# Altium schematic sheet Amplifier.SchDoc
size A; SheetNumber: 11; SheetTotal: 12
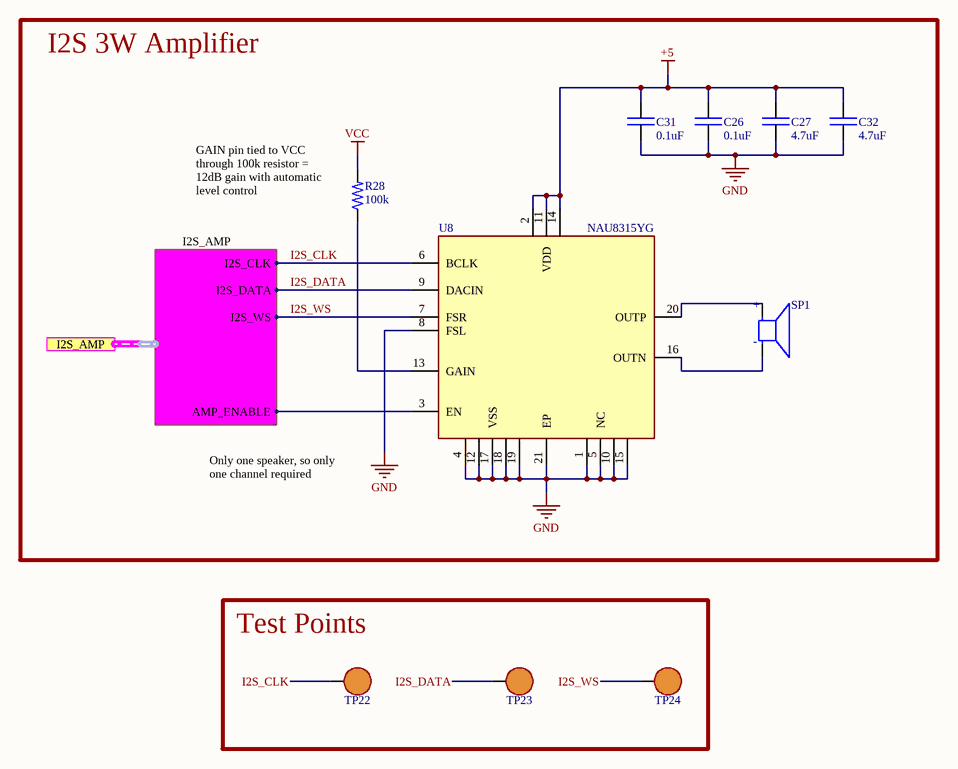
[diagram p0: Amplifier.SchDoc]

## Parts
C26  value 0.1uF  [0402C]  (hidden comment: CAP)
C27  value 4.7uF  [0402C]  (hidden comment: CAP)
C31  value 0.1uF  [0402C]  (hidden comment: CAP)
C32  value 4.7uF  [0402C]  (hidden comment: CAP)
R28  value 100k  [0402R]  (hidden comment: RES)
SP1  AS07104PO-LW152-R  [26AWG_AS04004PO-2-LW152-R_SideMount]  (value not drawn)
TP22  RCWCTE  [RCWCTE]  (value not drawn)
TP23  RCWCTE  [RCWCTE]  (value not drawn)
TP24  RCWCTE  [RCWCTE]  (value not drawn)
U8  NAU8315YG  [20-WFQFN-EP]

## Blocks framed on the sheet
I2S 3W Amplifier: C26 C27 C31 C32 R28 SP1 U8
Test Points: TP22-TP24

## Ports
I2S_AMP (harness I2S_AMP, see Brain-PCB_MASTER[4B], MCU[1B])

## Harnesses
I2S_AMP: I2S_CLK, I2S_DATA, I2S_WS, AMP_ENABLE

## Nets
+5: C26.2 C27.2 C31.2 C32.2 U8.2(VDD) U8.11(VDD) U8.14(VDD)
GND: C26.1 C27.1 C31.1 C32.1 U8.1(NC) U8.4(VSS) U8.5(NC) U8.8(FSL) U8.10(NC) U8.12(VSS) U8.15(NC) U8.17(VSS) U8.18(VSS) U8.19(VSS) U8.21(EP)
VCC: R28.2
I2S_CLK: TP22.1 U8.6(BCLK) ; port I2S_AMP.I2S_CLK
I2S_DATA: TP23.1 U8.9(DACIN) ; port I2S_AMP.I2S_DATA
I2S_WS: TP24.1 U8.7(FSR) ; port I2S_AMP.I2S_WS
NetR28_1: R28.1 U8.13(GAIN)
NetSP1_N: SP1.N U8.16(OUTN)
NetSP1_P: SP1.P U8.20(OUTP)
NetU8_3: U8.3(EN) ; port I2S_AMP.AMP_ENABLE

## Notes on the sheet
- (near R28) GAIN pin tied to VCC through 100k resistor = 12dB gain with automatic level control
- Only one speaker, so only one channel required
- (in symbol SPEAKER 4OHM 3W) +; -

## Library data of the parts
C26 C31 = CAP: Capacitor; MFR: Murata Electronics; MFR PN: GRM155R71C104KA88J; Type: SMD; Vendor: *; Vendor PN: *; Vendor Link: *
C27 C32 = CAP: Capacitor; MFR: Murata Electronics; MFR PN: GRM155D81C475ME15J; Type: SMD; Vendor: *; Vendor PN: *; Vendor Link: *
R28 = RES: Resistor; MFR PN: RC0402FR-07100KL; MFR: YAGEO; Tolerance: +/- 5%; Vendor: *; Vendor PN: *; Vendor Link: *; Type: SMD
SP1 = SPEAKER 4OHM 3W: SPEAKER 4OHM 3W TOP PORT 86DB; MFR: PUI Audio, Inc.; MFR PN: AS04004PO-2-LW152-R; Type: TH; Power Rating: 3W
TP22-TP24 = TEST POINT: Test Point, Surface Mount; MFR: KOA Speer Electronics, Inc.; MFR PN: RCWCTE; Type: SMD
U8 = I2S 3W AMP: I2S MONO 3.2W CLASS-D AMPLIFIER; MFR: Nuvoton; MFR PN: NAU8315YG; Value: *; Type: SMD; Power Rating: 3.2W